# Altium schematic sheet HV-Measurement.SchDoc
size A4
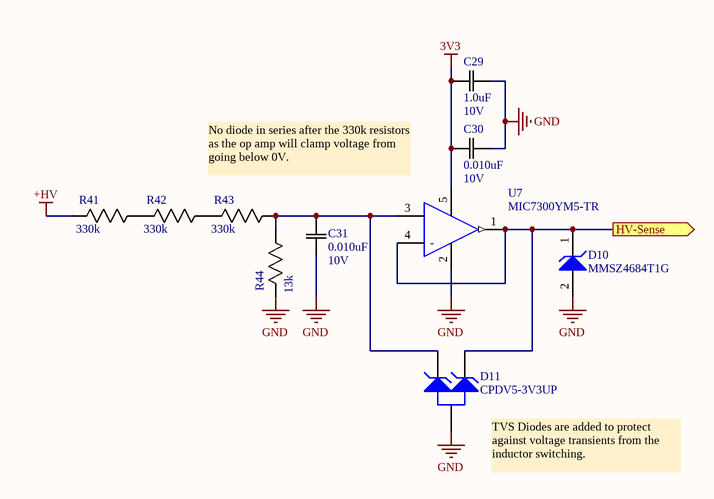
[diagram p0: HV-Measurement.SchDoc]

## Parts
C29  Rating: 10V  [0603]  (hidden comment: 1.0uF)
C30  Rating: 10V  [0603]  (hidden comment: 0.010uF)
C31  Rating: 10V  [0603]  (hidden comment: 0.010uF)
D10  MMSZ4684T1G  [ONSC-SOD-123-2-425-04_V]
D11  CPDV5-3V3UP  [ONSC-SOT-723-3-631AA-01_V]
R41  330k  [0805]
R42  330k  [0805]
R43  330k  [0805]
R44  13k  [0805]
U7  MIC7300YM5-TR  [FP-SOT23-5LD-PL-1-MFG]

## Ports
HV-Sense (out)

## Nets
3V3: C29.2(C2) C30.1(C1) U7.5(V+)
+HV: R41.2(R2)
GND: C29.1(C1) C30.2(C2) C31.1(C1) D10.2(A) D11.3(A) R44.2(R2) U7.2(V-)
HV-Sense: D10.1(K) D11.2(K2) U7.1(OUT) U7.4(IN-) ; port HV-Sense
NetC31_2: C31.2(C2) D11.1(K1) R43.1(R1) R44.1(R1) U7.3(IN+)
NetR41_1: R41.1(R1) R42.2(R2)
NetR42_1: R42.1(R1) R43.2(R2)

## Notes on the sheet
- No diode in series after the 330k resistors as the op amp will clamp voltage from going below 0V.
- (near D11) TVS Diodes are added to protect against voltage transients from the inductor switching.
- (in symbol CMP-06302-000001-1) -

## Library data of the parts
C29 = CAP 1.0uF 16V: CAP CER 1.0UF 10V X5R 0603; Tolerance: 10%; Package: 0603/0805; Temperature Coefficient: X5R; Operating Temperature: -55°C ~ 85°C; Value: 1.0uF; Supplier 1: Mouser; Supplier Part Number 1: 81-GRM033R61A105ME5J
C30 C31 = CAP 0.010uF 16V: CAP CER 0.010UF 10V X7R 0603; Tolerance: 10%; Temperature Coefficient: X5R; Package: 0603/0805; Operating Temperature: -55°C ~ 85°C; Value: 0.010uF; Supplier 1: Digi-Key; Supplier Part Number 1: 490-6040-1-ND
D10 = CMP-1060-00618-1: Zener Voltage Regulator, 500 mW, 2-Pin SOD-123, Pb-Free, Tape and Reel; Manufacturer: On Semiconductor; P Max (W): 0.5; VZ Typ (V): 3.3; ComponentLink2URL: http://www.onsemi.com/pub_link/Collateral/MMSZ4678T1-D.PDF; ComponentLink1URL: http://www.onsemi.com/; PartNumber: MMSZ4684T1G; ComponentLink2Description: Datasheet; ComponentLink3URL: http://www.onsemi.com/pub_link/Collateral/425-04.PDF; DatasheetVersion: Rev. 9; ComponentLink1Description: Manufacturer URL; RoHS: Pb-Free; ComponentLink3Description: Package Specification; PackageReference: SOD-123-2-425-04; PackageVersion: Rev. G, 10/2009; Mounting Technology: Surface Mount; Packing: Tape and Reel; PackageDescription: 2-Pin SOD, Body 1.6 x 2.69 mm
D11 = CMP-1063-00213-1: Transient Voltage Suppressor, ESD Protection Diode with Ultra-Low Capacitance, 3-Pin SOT-723, Pb-Free, Tape and Reel; PartNumber: ESD7L5.0DT5G; Manufacturer: On Semiconductor; IR Max (uA): 1; VRWM Max (V): 5; Direction: Unidirectional; V(BR) Min (V): 5.4; Number of Lines: 2; ComponentLink1URL: http://www.onsemi.com/; ComponentLink3Description: Package Specification; ComponentLink3URL: http://www.onsemi.com/pub_link/Collateral/631AA.PDF; ComponentLink2URL: http://www.onsemi.cn/pub_link/Collateral/ESD7L-D.PDF; PackageVersion: Rev. D, 08/2009; PackageDescription: 3-Pin Small Outline Transistor, Body 1.2 x 0.8 mm, Pitch 0.4 mm; Mounting Technology: Surface Mount; ComponentLink2Description: Datasheet; DatasheetVersion: Rev. 6; Packing: Tape and Reel; PackageReference: SOT-723-3-631AA-01; ComponentLink1Description: Manufacturer URL; RoHS: Pb-Free
R41 R43 = RES 330k 1/8W - 5%: RES SMD 330K OHM 5% 1/8W 0805; Power (Watts): 0.125W; Package: 0805; Value: 330k; Tolerance: 5%; Supplier 1: Digi-Key; Supplier Part Number 1: 541-330KCCT-ND
R42 = RES 330k 1/8W - 5%: CRCW0805330KFKEA; Power (Watts): 0.125W; Tolerance: 5%; Package: 0805; Value: 330k; ComponentLink1Description: New link; ComponentLink1URL: CRCW0805330KFKEA; Supplier 1: Digi-Key; Supplier Part Number 1: 541-330KCCT-ND
R44 = RES 13k 1/8W: RES SMD 13K OHM 5% 1/8W 0805; Power (Watts): 0.125W; Package: 0805; Value: 13k; Tolerance: 5%; Supplier 1: Mouser; Supplier Part Number 1: 71-CRCW080513K0FKEAC
U7 = CMP-06302-000001-1: IC OPAMP GP 1 CIRCUIT SOT23-5; Manufacturer: Microchip; Voltage Gain: 300-340V/mV; Gain Bandwidth: 0.55MHz; Min Supply Voltage: 2.2V; Max Junction Temp: +85°C; Input Bias Current: 0.0000005uA; Number Of Channels: 1; Input Offset Voltage: 1mV; Nominal Supply Current: 0.7-1.5mA; Max Supply Voltage: 10V; Standoff Height: 0mm; Mouser Description: Operational Amplifiers - Op Amps; Height: 1.45mm; Footprint Url: https://ww1.microchip.com/downloads/en/PackagingSpec/00000049CH.pdf; Temperature: -40°C to +85°C; Package: SOT23-5LD-PL-1; Automotive: No; Temperature Range High: +85°C; ComponentLink2URL: http://www.microchip.com/mymicrochip/filehandler.aspx?ddocname=en580613; Device Class L2: Linear ICs; Lead Free: Yes; ComponentLink2Description: Datasheet; Digikey Description: IC OPAMP GP 1 CIRCUIT SOT23-5; Device Class L3: Amplifiers - Op Amps; Manufacturer Part Number: MIC7300YM5-TR; Temperature Range Low: -40°C; Category: IC; RoHS: TRUE; Octopart: https://octopart.com/mic7300ym5-tr-microchip-66803593; Device Class L1: Integrated Circuits (ICs)